# Altium schematic sheet RPL_IMU.SchDoc: IMU
size A; Date: Dec 27, 2017; DrawnBy: Seyed Omid Hasanli; Revision: 1.0; SheetNumber: 7
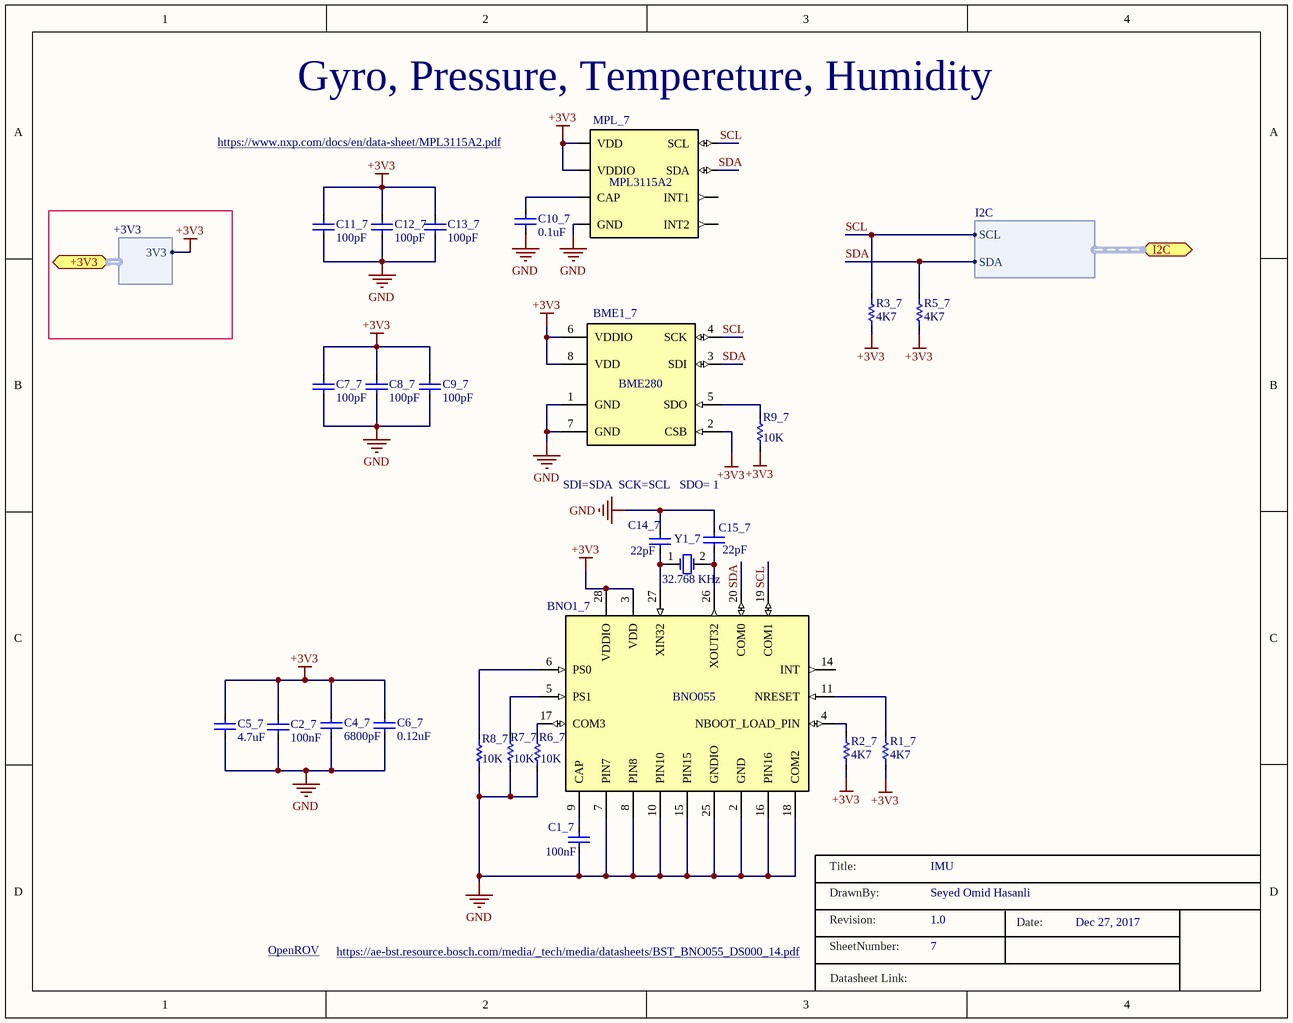
[diagram p0: RPL_IMU.SchDoc]

## Parts
BME1_7  BME280  [BME280]
BNO1_7  BNO055  [LGA28R50P4X10_380X520X100]
C1_7  value 100nF  [C0805C475K9RACAUTO]  (hidden comment: Cap)
C2_7  value 100nF  [C0805C475K9RACAUTO]  (hidden comment: Cap)
C4_7  value 6800pF  [C0805C475K9RACAUTO]  (hidden comment: Cap)
C5_7  value 4.7uF  [C0805C475K9RACAUTO]  (hidden comment: Cap)
C6_7  value 0.12uF  [C0805C475K9RACAUTO]  (hidden comment: Cap)
C7_7  value 100pF  [C0805C475K9RACAUTO]  (hidden comment: Cap)
C8_7  value 100pF  [C0805C475K9RACAUTO]  (hidden comment: Cap)
C9_7  value 100pF  [C0805C475K9RACAUTO]  (hidden comment: Cap)
C10_7  value 0.1uF  [C0805C475K9RACAUTO]  (hidden comment: Cap)
C11_7  value 100pF  [C0805C475K9RACAUTO]  (hidden comment: Cap)
C12_7  value 100pF  [C0805C475K9RACAUTO]  (hidden comment: Cap)
C13_7  value 100pF  [C0805C475K9RACAUTO]  (hidden comment: Cap)
C14_7  value 22pF  [C0805C475K9RACAUTO]  (hidden comment: Cap)
C15_7  value 22pF  [C0805C475K9RACAUTO]  (hidden comment: Cap)
MPL_7  MPL3115A2  [LGA8]
R1_7  value 4K7  [RES 0805]  (hidden comment: Res)
R2_7  value 4K7  [RES 0805]  (hidden comment: Res)
R3_7  value 4K7  [RES 0805]  (hidden comment: Res)
R5_7  value 4K7  [RES 0805]  (hidden comment: Res)
R6_7  value 10K  [RES 0805]  (hidden comment: Res)
R7_7  value 10K  [RES 0805]  (hidden comment: Res)
R8_7  value 10K  [RES 0805]  (hidden comment: Res)
R9_7  value 10K  [RES 0805]  (hidden comment: Res)
Y1_7  value 32.768 KHz  [FC-135R 32.7680KA-A3]  (hidden comment: 16MHz)

## Ports
+3V3 (harness +3V3), I2C (harness I2C)

## Harnesses
I2C: SDA, SCL
+3V3: 3V3

## Nets
+3V3: BME1_7.2(CSB) BME1_7.6(VDDIO) BME1_7.8(VDD) BNO1_7.3(VDD) BNO1_7.28(VDDIO) C2_7.2 C4_7.2 C5_7.2 C6_7.2 C7_7.2 C8_7.2 C9_7.2 C11_7.2 C12_7.2 C13_7.2 MPL_7.1(VDD) MPL_7.4(VDDIO) R1_7.1 R2_7.1 R3_7.1 R5_7.1 R9_7.1 ; port +3V3.3V3
GND: BME1_7.1(GND) BME1_7.7(GND) BNO1_7.2(GND) BNO1_7.7(PIN7) BNO1_7.8(PIN8) BNO1_7.10(PIN10) BNO1_7.15(PIN15) BNO1_7.16(PIN16) BNO1_7.18(COM2) BNO1_7.25(GNDIO) C1_7.1 C2_7.1 C4_7.1 C5_7.1 C6_7.1 C7_7.1 C8_7.1 C9_7.1 C10_7.1 C11_7.1 C12_7.1 C13_7.1 C14_7.1 C15_7.1 MPL_7.3(GND) R6_7.1 R7_7.1 R8_7.1
SCL: BME1_7.4(SCK) BNO1_7.19(COM1) MPL_7.8(SCL) R3_7.2 ; port I2C.SCL
SDA: BME1_7.3(SDI) BNO1_7.20(COM0) MPL_7.7(SDA) R5_7.2 ; port I2C.SDA
NetBME1_7_5: BME1_7.5(SDO) R9_7.2
NetBNO1_7_4: BNO1_7.4(NBOOT_LOAD_PIN) R2_7.2
NetBNO1_7_5: BNO1_7.5(PS1) R7_7.2
NetBNO1_7_6: BNO1_7.6(PS0) R8_7.2
NetBNO1_7_9: BNO1_7.9(CAP) C1_7.2
NetBNO1_7_11: BNO1_7.11(NRESET) R1_7.2
NetBNO1_7_17: BNO1_7.17(COM3) R6_7.2
NetBNO1_7_26: BNO1_7.26(XOUT32) C15_7.2 Y1_7.2(OSC2)
NetBNO1_7_27: BNO1_7.27(XIN32) C14_7.2 Y1_7.1(OSC1)
NetC10_7_2: C10_7.2 MPL_7.2(CAP)

Not connected (* = marked no-connect by the designer): BNO1_7 14(INT); MPL_7 5(INT2) 6(INT1)

## Notes on the sheet
- (near MPL_7) Gyro, Pressure, Tempereture, Humidity
- https://www.nxp.com/docs/en/data-sheet/MPL3115A2.pdf
- SDI=SDA  SCK=SCL   SDO= 1
- OpenROV <https://github.com/OpenROV/openrov-electronics/blob/master/OpenROV%20Depth:IMU%20Module%20v2%20Data%20Package/BNO055%2BMS5838BoB.v02%20Schematic.pdf>
- https://ae-bst.resource.bosch.com/media/_tech/media/datasheets/BST_BNO055_DS000_14.pdf
- Title:
- DrawnBy:
- Revision:
- SheetNumber:
- Date:
- Datasheet Link:

## Library data of the parts
BME1_7 = BME280: Integrated pressure, humidity and temperature sensor; 8-pin 2.5x2.5x0.93mm LGA; MF: Bosch; Package: LGA-8 Bosch; Availability: Good; MP: BME280; Price: 5.12 USD; Value: *
BNO1_7 = BNO055: BNO055 9-axis Absolute Orientation Sensor ( SiP ) w/Sensors and Sensor Fusion; MF: Bosch; MP: BNO055; Availability: Good; Package: LGA-28 Bosch; Price: 7.78 USD; Value: *
MPL_7 = MPL3115A2: Pressure Sensor, 50-110kpa, Lga-8; MF: NXP Semiconductors; MP: MPL3115A2; Availability: Good; Package: LGA-8 NXP Semiconductors; Price: 2.74 USD; Value: *
Y1_7 = XTAL